# Altium schematic sheet evmappboard.schdoc: Block Diagram
size 431 x 279 mm; DrawnBy: D. Bruey, M. Ciuffo; Organization: Synapse Product Development, LLC.; Address1: 1511 6th Ave., Suite 400; Address2: Seattle, Washington 98101; Address3: 206.381.0898; Address4: www.synapse.com; DocumentNumber: 1; SheetNumber: 1; SheetTotal: 7; PageSetup: Record=PageOptions|CenterHorizontal=True|CenterVertical=True|PrintScale=1.06|XCorrection=1.00|YCorrection=1.00|PrintKind=1|BorderSize=5000000|LeftOffset=0|BottomOffset=0|Orientation=2|PaperLength=4318|PaperWidth=2794|Scale=100|PaperSource=7|PrintQuality=200|MediaType=1|DitherType=10|PrintScaleMode=1|PaperKind=11x17|PaperIndex=3
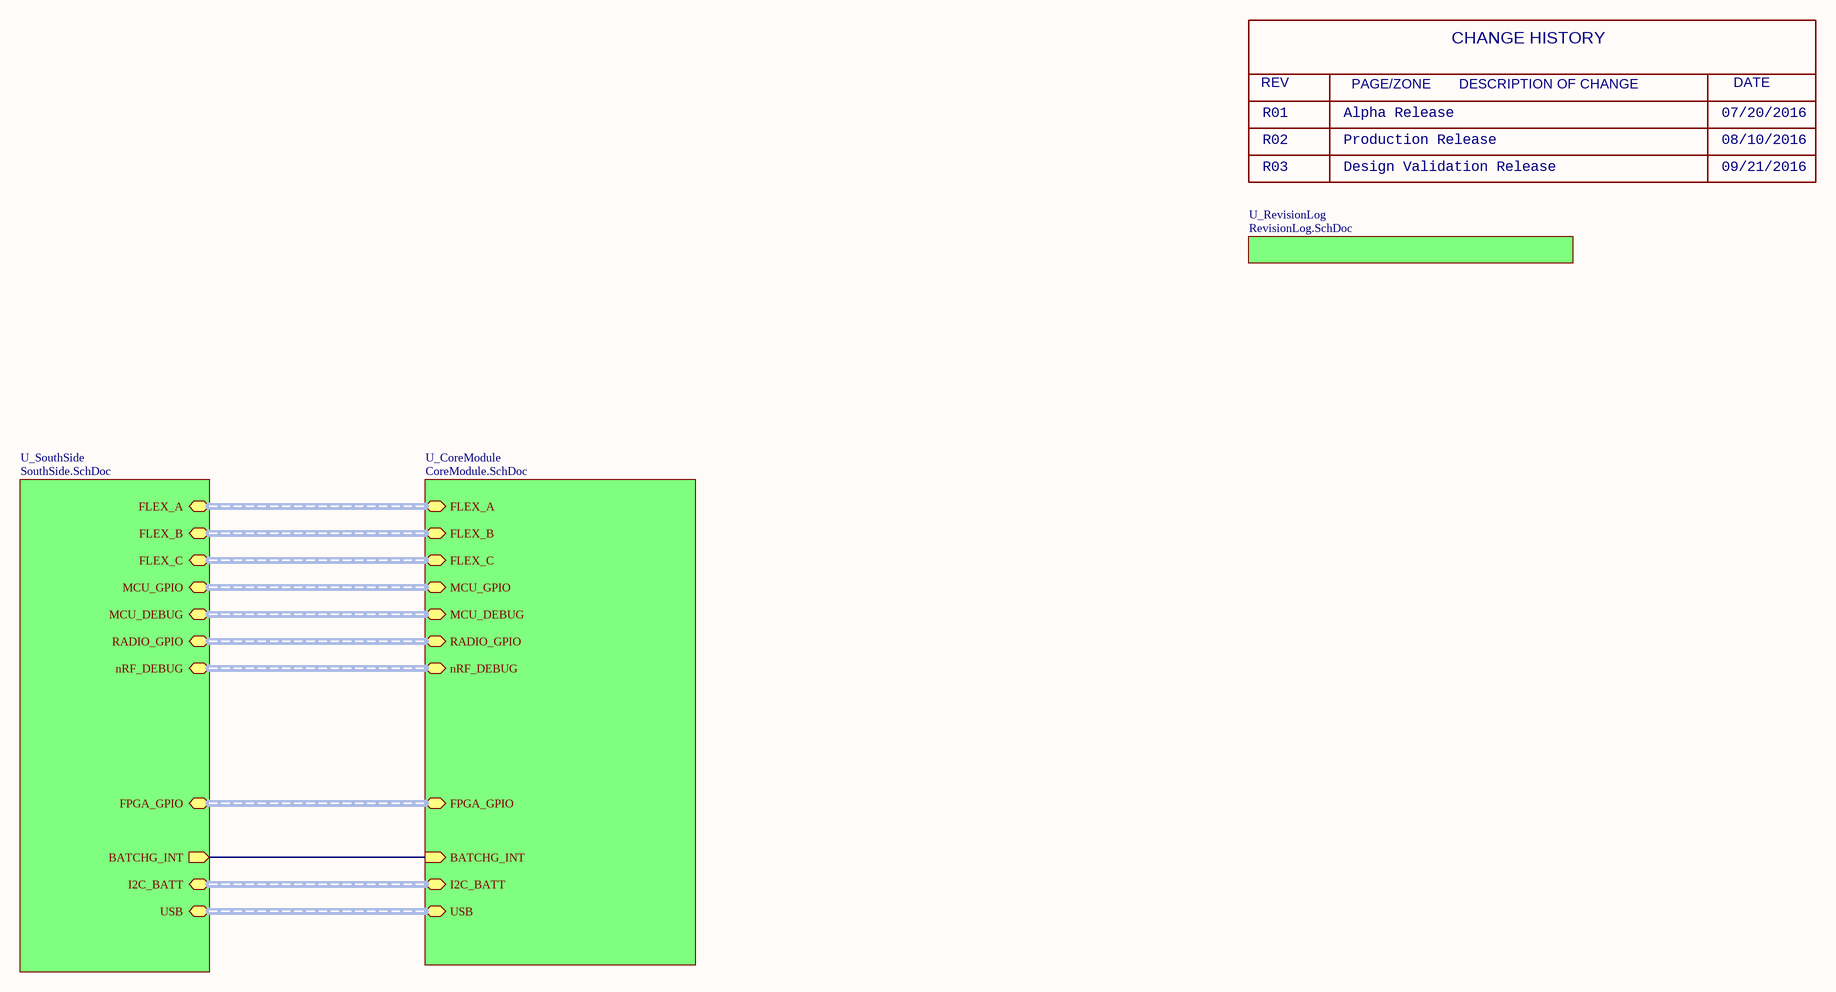
[diagram p0: evmappboard.schdoc]

## Sub-sheets
U_CoreModule = CoreModule.SchDoc: I2C_BATT (harness I2C), MCU_DEBUG (harness SWD), nRF_DEBUG (harness SWD), USB (harness USB), MCU_GPIO (harness MCU_IO), FLEX_C (harness SPI), FLEX_B (harness SPI), FLEX_A (harness SPI), BATCHG_INT (in), FPGA_GPIO (harness FPGA_IO), RADIO_GPIO (harness RADIO_IO)
U_RevisionLog = RevisionLog.SchDoc: no entries
U_SouthSide = SouthSide.SchDoc: I2C_BATT (harness I2C), MCU_DEBUG (harness SWD), nRF_DEBUG (harness SWD), USB (harness USB), MCU_GPIO (harness MCU_IO), FLEX_C (harness SPI), FLEX_B (harness SPI), FLEX_A (harness SPI), BATCHG_INT (out), FPGA_GPIO (harness FPGA_IO), RADIO_GPIO (harness RADIO_IO)

## Nets
(unnamed): sheet U_CoreModule/BATCHG_INT, sheet U_SouthSide/BATCHG_INT

## Buses and harness runs
harness sheet U_CoreModule/FLEX_A = sheet U_SouthSide/FLEX_A
harness sheet U_CoreModule/FLEX_B = sheet U_SouthSide/FLEX_B
harness sheet U_CoreModule/FLEX_C = sheet U_SouthSide/FLEX_C
harness sheet U_CoreModule/FPGA_GPIO = sheet U_SouthSide/FPGA_GPIO
harness sheet U_CoreModule/I2C_BATT = sheet U_SouthSide/I2C_BATT
harness sheet U_CoreModule/MCU_DEBUG = sheet U_SouthSide/MCU_DEBUG
harness sheet U_CoreModule/MCU_GPIO = sheet U_SouthSide/MCU_GPIO
harness sheet U_CoreModule/nRF_DEBUG = sheet U_SouthSide/nRF_DEBUG
harness sheet U_CoreModule/RADIO_GPIO = sheet U_SouthSide/RADIO_GPIO
harness sheet U_CoreModule/USB = sheet U_SouthSide/USB

## Notes on the sheet
- REV
- PAGE/ZONE       DESCRIPTION OF CHANGE
- CHANGE HISTORY
- DATE
- R01
- R02
- R03
- Alpha Release
- Production Release
- Design Validation Release
- 07/20/2016
- 08/10/2016
- 09/21/2016
- Design Notes:
- Layout Notes:
- Project:
- Sheet Title:
- PCBA:
- PROPRIETARY AND CONFIDENTIAL
- Drawn by:
- Schematic Part Number:
- Schematic Revision:
- Date:
- Sheet:
- /